# Altium schematic sheet Peripheral.SchDoc
size A4; SheetNumber: 3; SheetTotal: 4
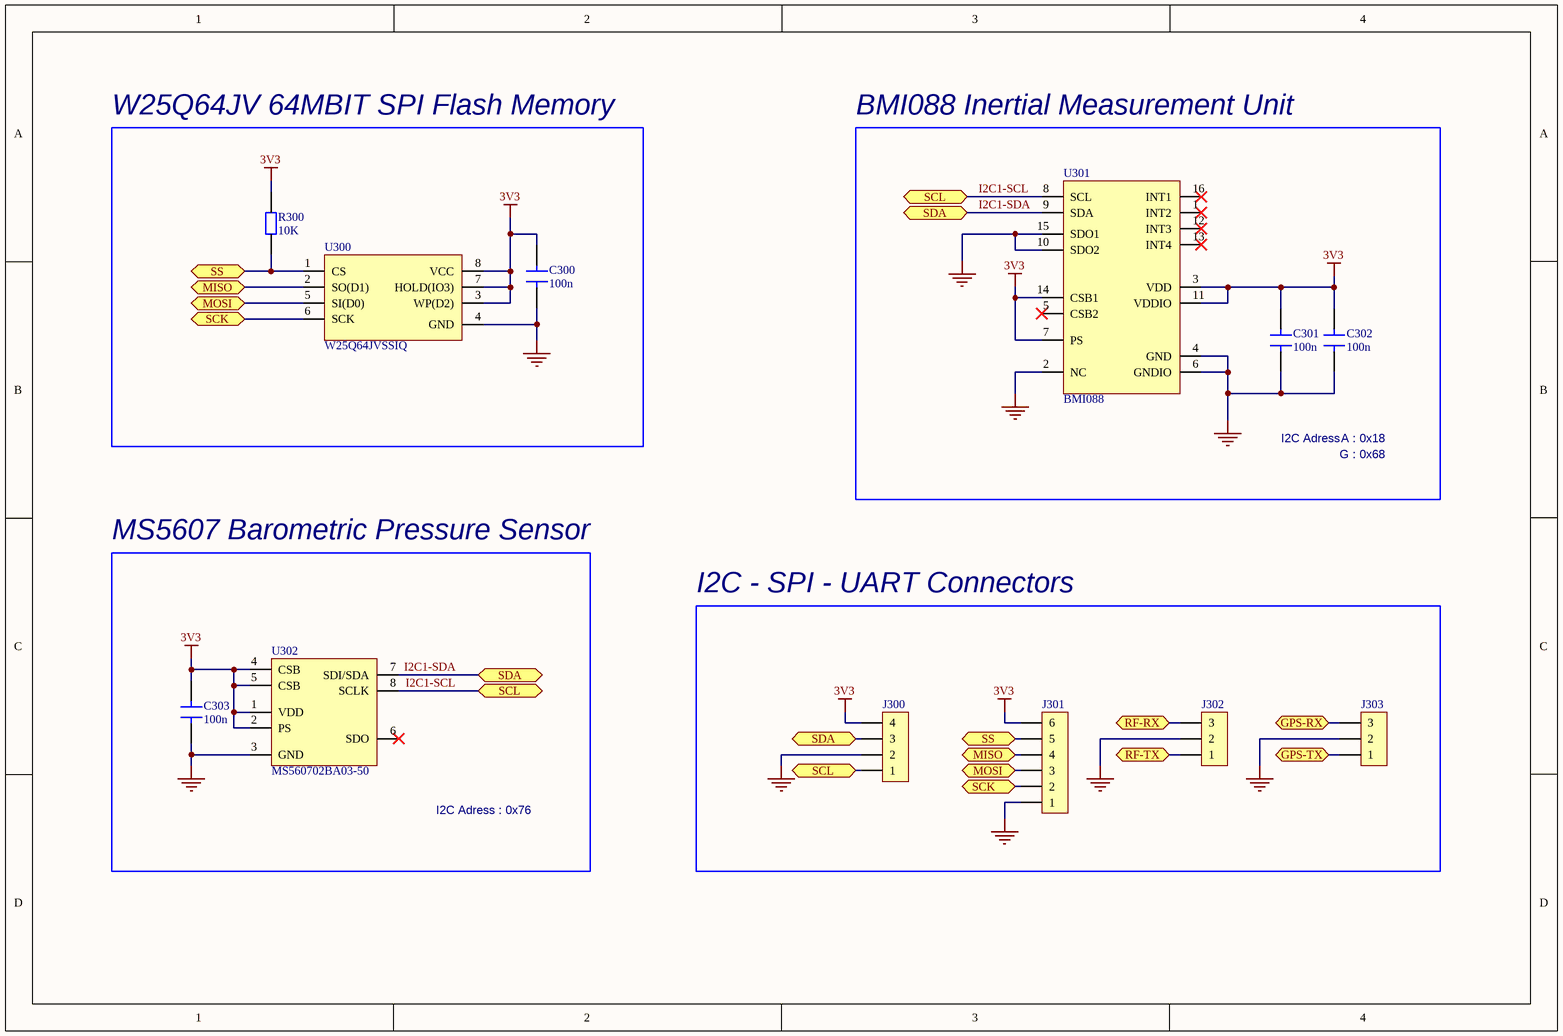
[diagram p0: Peripheral.SchDoc]

## Parts
C300  100n  [CAP 0603]
C301  100n  [CAP 0603]
C302  100n  [CAP 0603]
C303  100n  [CAP 0603]
J300  1x4 HEADER MALE  [1X4 HEADER MALE]  (value not drawn)
J301  1x6 HEADER MALE  [1X6 HEADER MALE]  (value not drawn)
J302  JST B3B-XH-A  [JST_B3B-XH-A]  (value not drawn)
J303  JST B3B-XH-A  [JST_B3B-XH-A]  (value not drawn)
R300  10K  [RES 0603]
U300  W25Q64JVSSIQ  [W25Q64JVSSIQ]
U301  BMI088  [BMI088]
U302  MS560702BA03-50  [MS5607-02BA3]

## Blocks framed on the sheet
W25Q64JV 64MBIT SPI Flash Memory: C300 R300 U300
BMI088 Inertial Measurement Unit: C301 C302 U301
MS5607 Barometric Pressure Sensor: C303 U302
I2C - SPI - UART Connectors: J300-J303

## Ports
GPS-RX (bidir, see MCU[7D]), GPS-TX (bidir, see MCU[7D]), MISO (bidir, see MCU[7C], Peripheral[1B]), MISO (bidir, see MCU[7C], Peripheral[3C]), MOSI (bidir, see MCU[7C], Peripheral[1B]), MOSI (bidir, see MCU[7C], Peripheral[3C]), RF-RX (bidir, see MCU[7D]), RF-TX (bidir, see MCU[7D]), SCK (bidir, see MCU[7C], Peripheral[1B]), SCK (bidir, see MCU[7C], Peripheral[3D]), SCL (bidir, see MCU[7D], Peripheral[2C], Peripheral[3A]), SCL (bidir, see MCU[7D], Peripheral[2C], Peripheral[3C]), SCL (bidir, see MCU[7D], Peripheral[3A], Peripheral[3C]), SDA (bidir, see MCU[7D], Peripheral[2C], Peripheral[3A]), SDA (bidir, see MCU[7D], Peripheral[2C], Peripheral[3C]), SDA (bidir, see MCU[7D], Peripheral[3A], Peripheral[3C]), SS (bidir, see MCU[7D], Peripheral[1B]), SS (bidir, see MCU[7D], Peripheral[3C])

## Nets
3V3: C300.1 C301.2 C302.2 C303.2 J300.4 J301.6 R300.2 U300.3(WP(D2)) U300.7(HOLD(IO3)) U300.8(VCC) U301.3(VDD) U301.7(PS) U301.11(VDDIO) U301.14(CSB1) U302.1(VDD) U302.2(PS) U302.4(CSB) U302.5(CSB)
GND: C300.2 C301.1 C302.1 C303.1 J300.2 J301.1 J302.2 J303.2 U300.4(GND) U301.2(NC) U301.4(GND) U301.6(GNDIO) U301.10(SDO2) U301.15(SDO1) U302.3(GND)
GPS-RX: J303.3 ; port GPS-RX
GPS-TX: J303.1 ; port GPS-TX
I2C1-SCL: J300.1 U301.8(SCL) U302.8(SCLK) ; port SCL
I2C1-SDA: J300.3 U301.9(SDA) U302.7(SDI/SDA) ; port SDA
MISO: J301.4 U300.2(SO(D1)) ; port MISO
MOSI: J301.3 U300.5(SI(D0)) ; port MOSI
RF-RX: J302.3 ; port RF-RX
RF-TX: J302.1 ; port RF-TX
SCK: J301.2 U300.6(SCK) ; port SCK
SS: J301.5 R300.1 U300.1(CS) ; port SS

Not connected (* = marked no-connect by the designer): U301 1(INT2)* 5(CSB2)* 12(INT3)* 13(INT4)* 16(INT1)*; U302 6(SDO)*

## Notes on the sheet
- I2C Adress
- A : 0x18
- G : 0x68
- I2C Adress : 0x76

## Library data of the parts
C300-C303 = CAP 0603 50V: Capacitor SMD 0603 50V
J302 J303 = JST B3B-XH-A: Connector Header, XH Series, 3 Position, 2.50mm, Through Hole, Press-Fit, Solder, Natural; Manufacturer Part Number: B3B-XH-A(LF)(SN); Supplier 1: CoreStaff; Manufacturer: JST; RoHS: Yes; Category: Headers and Wire Housings; Stock 1: 2101; Pricing 1: 1=39,94, 10=25,1, 50=21,68, 100=18,25, 500=17,57, 1000=17,12, 2000=16,44, 4000=15,79 (JPY); ComponentLink1URL: https://datasheet.ciiva.com/26894/getdatasheetpartid-640434-26894454.pdf?src-supplier=Verical; ComponentLink1Description: https://datasheet.ciiva.com/26894/getdatasheetpartid-640434-26894454.pdf?src-supplier=Verical; ComponentLink2URL: https://datasheet.ciiva.com/26894/getdatasheetpartid-440399-26894778.pdf?src-supplier=Verical; ComponentLink2Description: https://datasheet.ciiva.com/26894/getdatasheetpartid-440399-26894778.pdf?src-supplier=Verical; ComponentLink3URL: https://datasheet.ciiva.com/11746/0900766b8082653f-11746520.pdf?src-supplier=Rs; ComponentLink3Description: https://datasheet.ciiva.com/11746/0900766b8082653f-11746520.pdf?src-supplier=Rs
R300 = RES 0603: Resistor SMD 0603
U300 = W25Q64JVSSIQ: IC FLASH 64MBIT 104MHZ 8SOIC; Manufacturer: Winbond; Memory Type: Non-Volatile,FLASH; Frequency: 133MHz; Memory Size: 64Mb; Supplier 1: Digi-Key; Manufacturer Part Number: W25Q64JVSSIQ; RoHS: Yes; Category: Flash; Stock 1: 138661; Pricing 1: 1=1,03, 25=0,9212, 100=0,8173, 500=0,7987, 5000=0,72112 (USD); Mount: Surface Mount; Case/Package: SOIC; Number of Pins: 8; Min Operating Temperature: -40°C; Max Operating Temperature: 85°C; Packaging: Rail/Tube; Series: SpiFlash®; RoHS Compliant: Yes; ComponentLink1URL: http://www.winbond.com/resource-files/w25q64jv%20revj%2003272018%20plus.pdf?src-supplier=Digi-Key; ComponentLink1Description: http://www.winbond.com/resource-files/w25q64jv%20revj%2003272018%20plus.pdf?src-supplier=Digi-Key
U301 = BMI088: BMI088 Series 3.6 V 6 Axis Digital Output Accelerometer Motion Sensor - LGA-16; Manufacturer: Bosch Tools; Supplier 1: Arrow Electronics; Manufacturer Part Number: BMI088; RoHS: No; Category: Inertial Measurement Units (IMUs); Stock 1: 2228; Pricing 1: 1=3,4884, 10=3,3155, 25=3,2816, 50=3,2477, 100=3,2147, 500=3,1828 (USD); ComponentLink1URL: https://ae-bst.resource.bosch.com/media/_tech/media/product_flyer/Bosch_Sensortec_Product_flyer_BMI088.pdf?src-supplier=Digi-Key; ComponentLink1Description: https://ae-bst.resource.bosch.com/media/_tech/media/product_flyer/Bosch_Sensortec_Product_flyer_BMI088.pdf?src-supplier=Digi-Key; ComponentLink2URL: https://ae-bst.resource.bosch.com/media/_tech/media/application_notes/BST-MIS-HS001.pdf?src-supplier=Digi-Key; ComponentLink2Description: https://ae-bst.resource.bosch.com/media/_tech/media/application_notes/BST-MIS-HS001.pdf?src-supplier=Digi-Key
U302 = MS560702BA03-50: Board Mount Pressure Sensor 0.01bar to 1.2bar Absolute 8-Pin QFN T/R; Manufacturer: Measurement Specialties; Min Supply Voltage: 1.8V; Max Supply Voltage: 3.6V; Pressure Type: Barometric; Supply Current: 12.5uA; Supplier 1: Utmel Electronic; Manufacturer Part Number: MS560702BA03-50; RoHS: Yes; Category: Pressure Sensors; Stock 1: 4561; Case/Package: QFN; Number of Pins: 8; Min Operating Temperature: -40°C; Max Operating Temperature: 85°C; Reach SVHC Compliant: No; RoHS Compliant: Yes; ComponentLink1URL: https://datasheet.ciiva.com/28418/1756127-28418369.pdf?src-supplier=Element14; ComponentLink1Description: https://datasheet.ciiva.com/28418/1756127-28418369.pdf?src-supplier=Element14; ComponentLink2URL: https://datasheet.ciiva.com/45422/ms5607-02ba03-45422949.pdf?src-supplier=Digi-Key; ComponentLink2Description: https://datasheet.ciiva.com/45422/ms5607-02ba03-45422949.pdf?src-supplier=Digi-Key; ComponentLink3URL: https://datasheet.ciiva.com/45422/ms5607-02ba03-45422950.pdf?src-supplier=Digi-Key; ComponentLink3Description: https://datasheet.ciiva.com/45422/ms5607-02ba03-45422950.pdf?src-supplier=Digi-Key; ComponentLink4URL: https://datasheet.ciiva.com/45422/ms5607-02ba03-45422951.pdf?src-supplier=Digi-Key; ComponentLink4Description: https://datasheet.ciiva.com/45422/ms5607-02ba03-45422951.pdf?src-supplier=Digi-Key